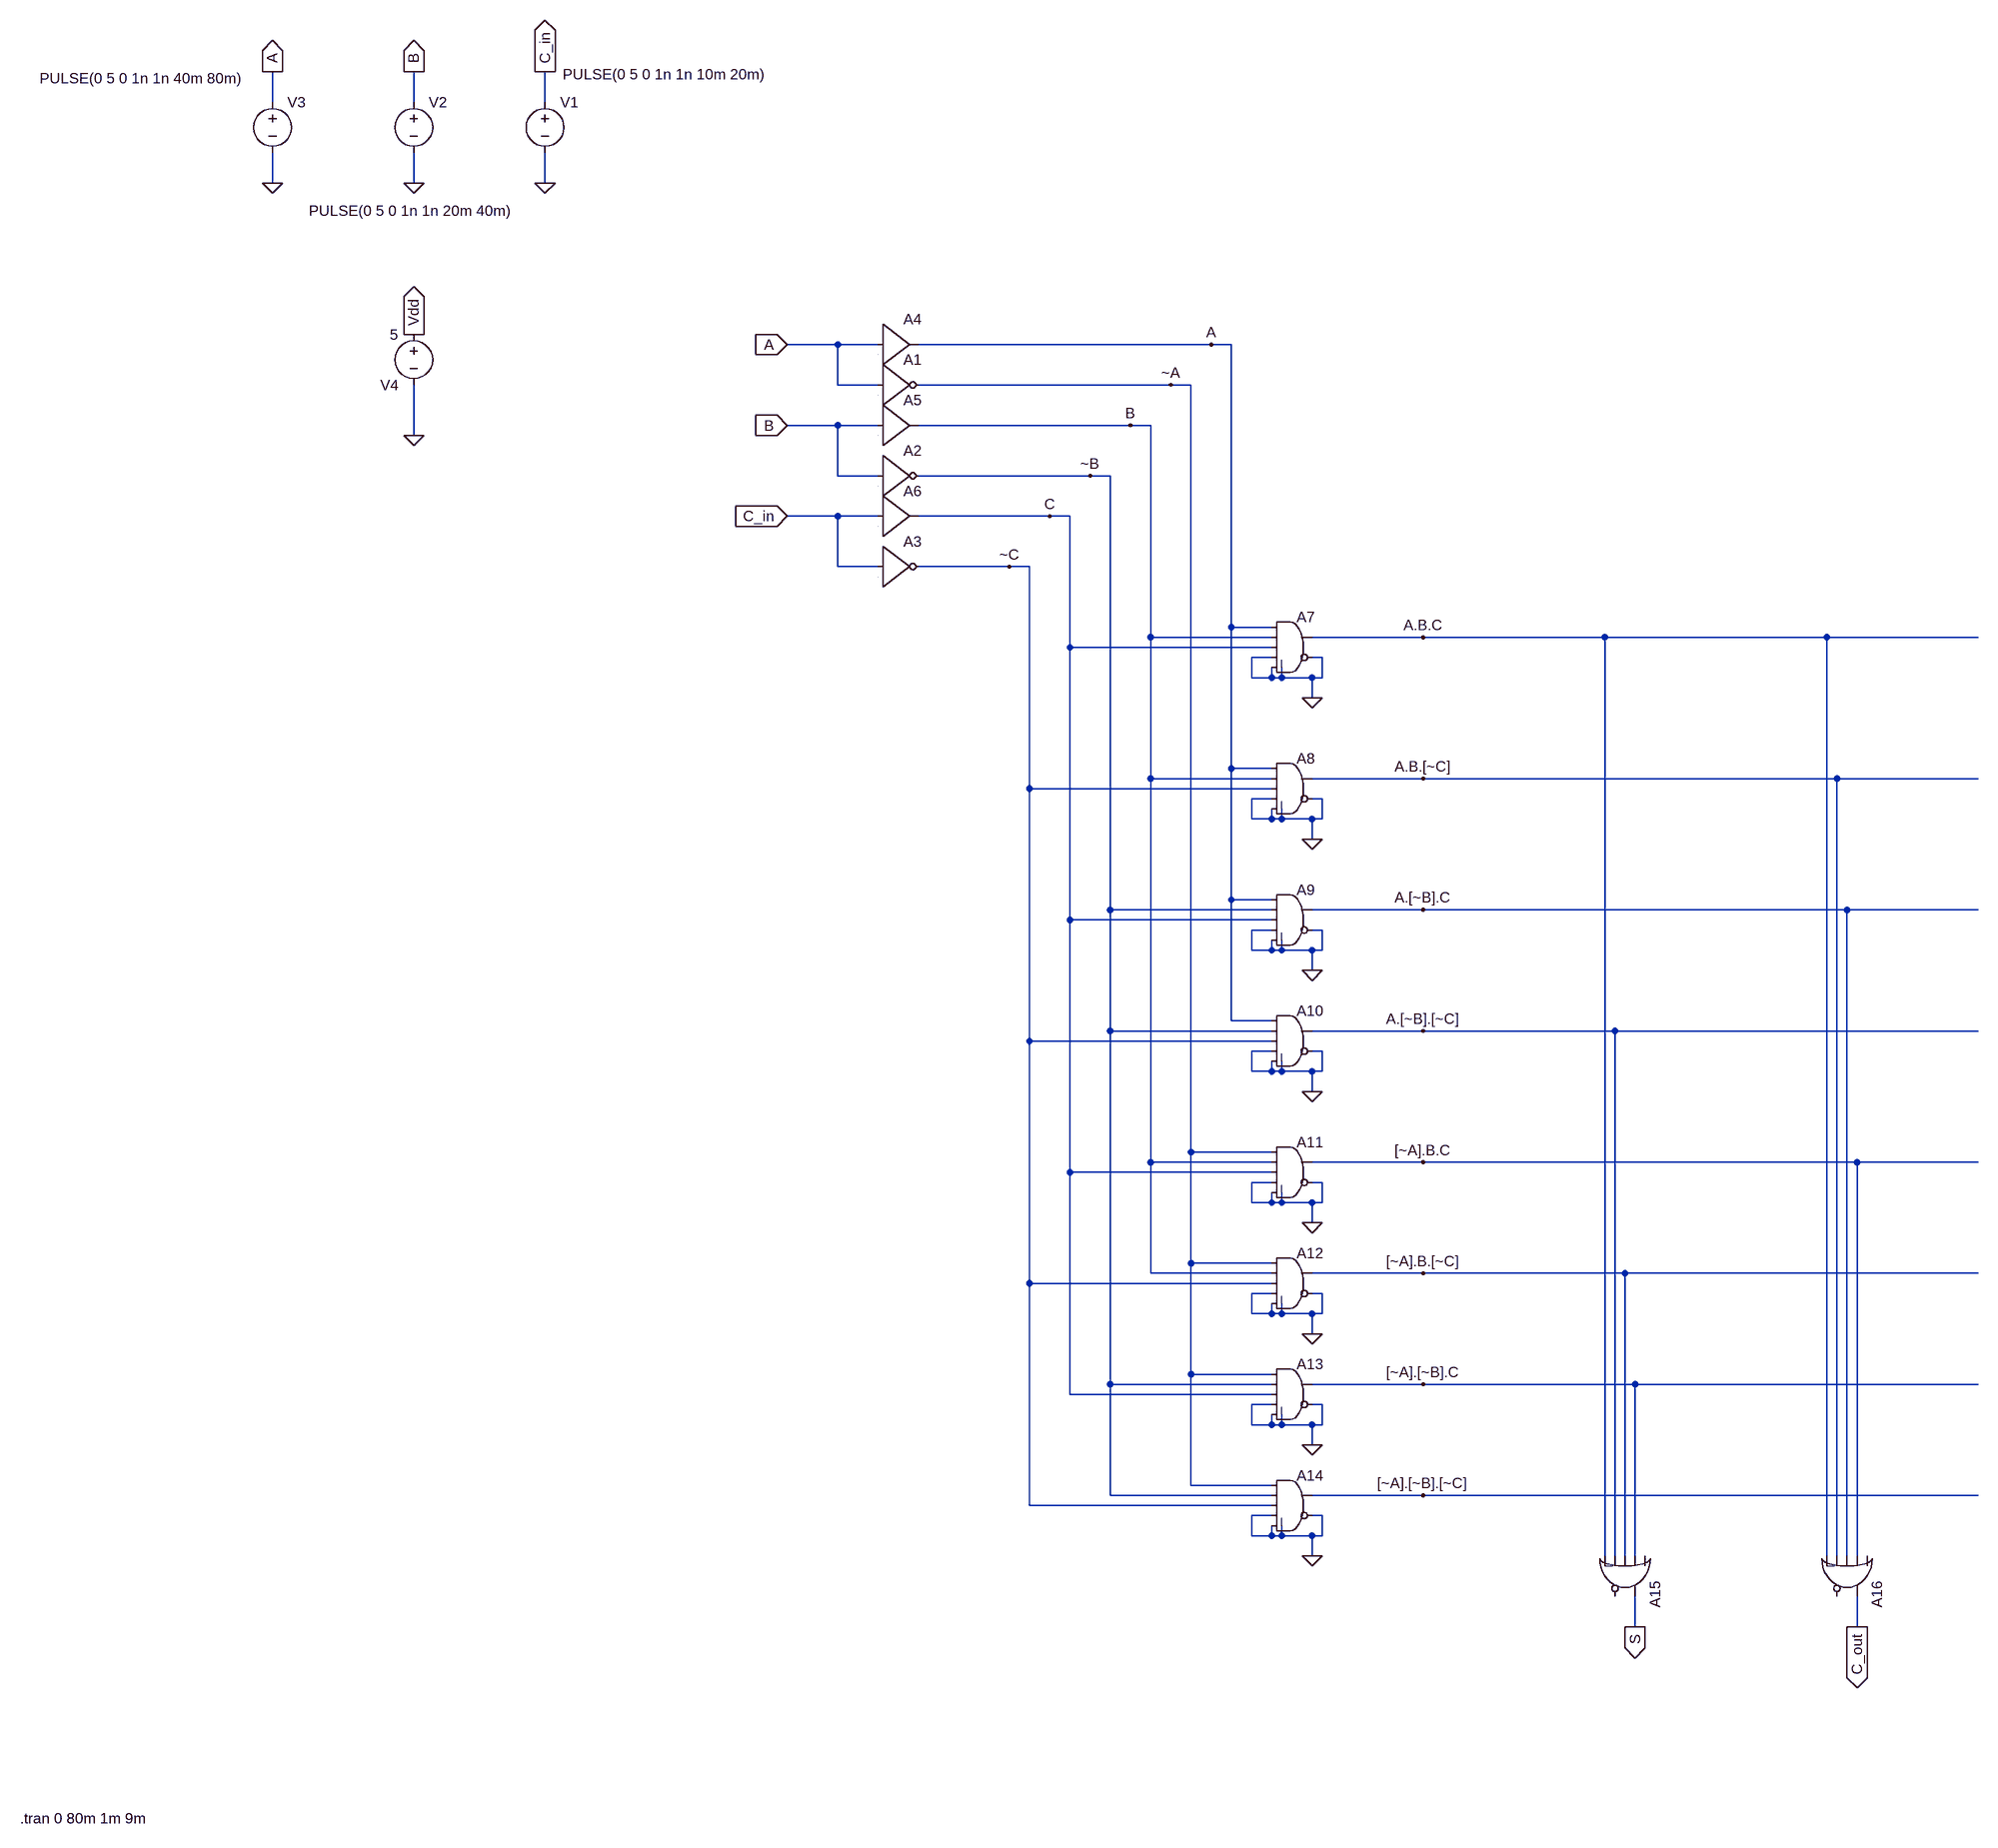
[diagram p0: schematic Full_Adder_with_AND_OR.asc]
Full_Adder_with_AND_OR.asc, the LTspice schematic file:
Version 4
SHEET 1 3172 2128
WIRE -944 -608 -944 -656
WIRE -720 -608 -720 -656
WIRE -512 -608 -512 -656
WIRE -944 -480 -944 -528
WIRE -720 -480 -720 -528
WIRE -512 -480 -512 -528
WIRE -48 -224 -128 -224
WIRE 16 -224 -48 -224
WIRE 544 -224 80 -224
WIRE 576 -224 544 -224
WIRE -48 -160 -48 -224
WIRE 16 -160 -48 -160
WIRE 480 -160 80 -160
WIRE 512 -160 480 -160
WIRE -48 -96 -128 -96
WIRE 16 -96 -48 -96
WIRE 416 -96 80 -96
WIRE 448 -96 416 -96
WIRE -720 -80 -720 -160
WIRE -48 -16 -48 -96
WIRE 16 -16 -48 -16
WIRE 352 -16 80 -16
WIRE 384 -16 352 -16
WIRE -48 48 -128 48
WIRE 16 48 -48 48
WIRE 288 48 80 48
WIRE 320 48 288 48
WIRE -48 128 -48 48
WIRE 16 128 -48 128
WIRE 224 128 80 128
WIRE 256 128 224 128
WIRE 576 224 576 -224
WIRE 640 224 576 224
WIRE 448 240 448 -96
WIRE 640 240 448 240
WIRE 880 240 704 240
WIRE 1168 240 880 240
WIRE 1520 240 1168 240
WIRE 1760 240 1520 240
WIRE 320 256 320 48
WIRE 640 256 320 256
WIRE 640 272 608 272
WIRE 720 272 704 272
WIRE 608 304 608 272
WIRE 640 304 640 288
WIRE 640 304 608 304
WIRE 656 304 656 288
WIRE 656 304 640 304
WIRE 704 304 656 304
WIRE 720 304 720 272
WIRE 720 304 704 304
WIRE 704 336 704 304
WIRE 576 448 576 224
WIRE 640 448 576 448
WIRE 448 464 448 240
WIRE 640 464 448 464
WIRE 880 464 704 464
WIRE 1536 464 880 464
WIRE 1760 464 1536 464
WIRE 256 480 256 128
WIRE 640 480 256 480
WIRE 640 496 608 496
WIRE 720 496 704 496
WIRE 608 528 608 496
WIRE 640 528 640 512
WIRE 640 528 608 528
WIRE 656 528 656 512
WIRE 656 528 640 528
WIRE 704 528 656 528
WIRE 720 528 720 496
WIRE 720 528 704 528
WIRE 704 560 704 528
WIRE 576 656 576 448
WIRE 640 656 576 656
WIRE 384 672 384 -16
WIRE 640 672 384 672
WIRE 880 672 704 672
WIRE 1552 672 880 672
WIRE 1760 672 1552 672
WIRE 320 688 320 256
WIRE 640 688 320 688
WIRE 640 704 608 704
WIRE 720 704 704 704
WIRE 608 736 608 704
WIRE 640 736 640 720
WIRE 640 736 608 736
WIRE 656 736 656 720
WIRE 656 736 640 736
WIRE 704 736 656 736
WIRE 720 736 720 704
WIRE 720 736 704 736
WIRE 704 768 704 736
WIRE 576 848 576 656
WIRE 640 848 576 848
WIRE 384 864 384 672
WIRE 640 864 384 864
WIRE 880 864 704 864
WIRE 1184 864 880 864
WIRE 1760 864 1184 864
WIRE 256 880 256 480
WIRE 640 880 256 880
WIRE 640 896 608 896
WIRE 720 896 704 896
WIRE 608 928 608 896
WIRE 640 928 640 912
WIRE 640 928 608 928
WIRE 656 928 656 912
WIRE 656 928 640 928
WIRE 704 928 656 928
WIRE 720 928 720 896
WIRE 720 928 704 928
WIRE 704 960 704 928
WIRE 512 1056 512 -160
WIRE 640 1056 512 1056
WIRE 448 1072 448 464
WIRE 640 1072 448 1072
WIRE 880 1072 704 1072
WIRE 1568 1072 880 1072
WIRE 1760 1072 1568 1072
WIRE 320 1088 320 688
WIRE 640 1088 320 1088
WIRE 640 1104 608 1104
WIRE 720 1104 704 1104
WIRE 608 1136 608 1104
WIRE 640 1136 640 1120
WIRE 640 1136 608 1136
WIRE 656 1136 656 1120
WIRE 656 1136 640 1136
WIRE 704 1136 656 1136
WIRE 720 1136 720 1104
WIRE 720 1136 704 1136
WIRE 704 1168 704 1136
WIRE 512 1232 512 1056
WIRE 640 1232 512 1232
WIRE 448 1248 448 1072
WIRE 640 1248 448 1248
WIRE 880 1248 704 1248
WIRE 1200 1248 880 1248
WIRE 1760 1248 1200 1248
WIRE 256 1264 256 880
WIRE 640 1264 256 1264
WIRE 640 1280 608 1280
WIRE 720 1280 704 1280
WIRE 608 1312 608 1280
WIRE 640 1312 640 1296
WIRE 640 1312 608 1312
WIRE 656 1312 656 1296
WIRE 656 1312 640 1312
WIRE 704 1312 656 1312
WIRE 720 1312 720 1280
WIRE 720 1312 704 1312
WIRE 704 1344 704 1312
WIRE 512 1408 512 1232
WIRE 640 1408 512 1408
WIRE 384 1424 384 864
WIRE 640 1424 384 1424
WIRE 880 1424 704 1424
WIRE 1216 1424 880 1424
WIRE 1760 1424 1216 1424
WIRE 320 1440 320 1088
WIRE 640 1440 320 1440
WIRE 640 1456 608 1456
WIRE 720 1456 704 1456
WIRE 608 1488 608 1456
WIRE 640 1488 640 1472
WIRE 640 1488 608 1488
WIRE 656 1488 656 1472
WIRE 656 1488 640 1488
WIRE 704 1488 656 1488
WIRE 720 1488 720 1456
WIRE 720 1488 704 1488
WIRE 704 1520 704 1488
WIRE 512 1584 512 1408
WIRE 640 1584 512 1584
WIRE 384 1600 384 1424
WIRE 640 1600 384 1600
WIRE 880 1600 704 1600
WIRE 1760 1600 880 1600
WIRE 256 1616 256 1264
WIRE 640 1616 256 1616
WIRE 640 1632 608 1632
WIRE 720 1632 704 1632
WIRE 608 1664 608 1632
WIRE 640 1664 640 1648
WIRE 640 1664 608 1664
WIRE 656 1664 656 1648
WIRE 656 1664 640 1664
WIRE 704 1664 656 1664
WIRE 720 1664 720 1632
WIRE 720 1664 704 1664
WIRE 704 1696 704 1664
WIRE 1168 1696 1168 240
WIRE 1184 1696 1184 864
WIRE 1200 1696 1200 1248
WIRE 1216 1696 1216 1424
WIRE 1520 1696 1520 240
WIRE 1536 1696 1536 464
WIRE 1552 1696 1552 672
WIRE 1568 1696 1568 1072
WIRE 1216 1808 1216 1760
WIRE 1568 1808 1568 1760
FLAG -128 -224 A
IOPIN -128 -224 In
FLAG -128 -96 B
IOPIN -128 -96 In
FLAG -128 48 C_in
IOPIN -128 48 In
FLAG 544 -224 A
FLAG 480 -160 ~A
FLAG 416 -96 B
FLAG 352 -16 ~B
FLAG 288 48 C
FLAG 224 128 ~C
FLAG -512 -480 0
FLAG -720 -480 0
FLAG -944 -480 0
FLAG -944 -656 A
IOPIN -944 -656 Out
FLAG -720 -656 B
IOPIN -720 -656 Out
FLAG -512 -656 C_in
IOPIN -512 -656 Out
FLAG 704 336 0
FLAG 1216 1808 S
IOPIN 1216 1808 Out
FLAG 704 560 0
FLAG 704 768 0
FLAG 704 960 0
FLAG 704 1168 0
FLAG 704 1344 0
FLAG 704 1520 0
FLAG 704 1696 0
FLAG -720 -80 0
FLAG -720 -240 Vdd
IOPIN -720 -240 Out
FLAG 880 240 A.B.C
FLAG 880 464 A.B.[~C]
FLAG 880 672 A.[~B].C
FLAG 880 864 A.[~B].[~C]
FLAG 880 1072 [~A].B.C
FLAG 880 1248 [~A].B.[~C]
FLAG 880 1424 [~A].[~B].C
FLAG 880 1600 [~A].[~B].[~C]
FLAG 1568 1808 C_out
IOPIN 1568 1808 Out
SYMBOL Digital\\inv 16 -224 R0
SYMATTR InstName A1
SYMATTR Value2 Vhigh=5 Vlow=0
SYMBOL Digital\\inv 16 -80 R0
SYMATTR InstName A2
SYMATTR Value2 Vhigh=5 Vlow=0
SYMBOL Digital\\inv 16 64 R0
SYMATTR InstName A3
SYMATTR Value2 Vhigh=5 Vlow=0
SYMBOL Digital\\buf1 16 -288 R0
SYMATTR InstName A4
SYMATTR Value2 Vhigh=5 Vlow=0
SYMBOL Digital\\buf1 16 -160 R0
SYMATTR InstName A5
SYMATTR Value2 Vhigh=5 Vlow=0
SYMBOL Digital\\buf1 16 -16 R0
SYMATTR InstName A6
SYMATTR Value2 Vhigh=5 Vlow=0
SYMBOL Digital\\and 672 192 R0
SYMATTR InstName A7
SYMATTR Value2 Vhigh=5 Vlow=0
SYMBOL voltage -512 -624 R0
WINDOW 123 0 0 Left 0
WINDOW 39 0 0 Left 0
WINDOW 3 28 -28 Left 2
SYMATTR Value PULSE(0 5 0 1n 1n 10m 20m)
SYMATTR InstName V1
SYMBOL voltage -720 -624 R0
WINDOW 123 0 0 Left 0
WINDOW 39 0 0 Left 0
WINDOW 3 -166 188 Left 2
SYMATTR Value PULSE(0 5 0 1n 1n 20m 40m)
SYMATTR InstName V2
SYMBOL voltage -944 -624 R0
WINDOW 123 0 0 Left 0
WINDOW 39 0 0 Left 0
WINDOW 3 -369 -22 Left 2
SYMATTR Value PULSE(0 5 0 1n 1n 40m 80m)
SYMATTR InstName V3
SYMBOL Digital\\and 672 416 R0
SYMATTR InstName A8
SYMATTR Value2 Vhigh=5 Vlow=0
SYMBOL Digital\\and 672 624 R0
SYMATTR InstName A9
SYMATTR Value2 Vhigh=5 Vlow=0
SYMBOL Digital\\and 672 816 R0
SYMATTR InstName A10
SYMATTR Value2 Vhigh=5 Vlow=0
SYMBOL Digital\\and 672 1024 R0
SYMATTR InstName A11
SYMATTR Value2 Vhigh=5 Vlow=0
SYMBOL Digital\\and 672 1200 R0
SYMATTR InstName A12
SYMATTR Value2 Vhigh=5 Vlow=0
SYMBOL Digital\\and 672 1376 R0
SYMATTR InstName A13
SYMATTR Value2 Vhigh=5 Vlow=0
SYMBOL Digital\\and 672 1552 R0
SYMATTR InstName A14
SYMATTR Value2 Vhigh=5 Vlow=0
SYMBOL voltage -720 -256 M0
WINDOW 0 24 96 Left 2
WINDOW 3 24 16 Left 2
WINDOW 123 0 0 Left 0
WINDOW 39 0 0 Left 0
SYMATTR InstName V4
SYMATTR Value 5
SYMBOL Digital\\or 1264 1728 R90
SYMATTR InstName A15
SYMATTR Value2 Vhigh=5 Vlow=0
SYMBOL Digital\\or 1616 1728 R90
SYMATTR InstName A16
SYMATTR Value2 Vhigh=5 Vlow=0
TEXT -1344 2112 Left 2 !.tran 0 80m 1m 9m

The netlist it stands for:
* Full_Adder_with_AND_OR.asc
A1 A 0 0 0 0 ~A 0 0 BUF Vhigh=5 Vlow=0
A2 B 0 0 0 0 ~B 0 0 BUF Vhigh=5 Vlow=0
A3 C_in 0 0 0 0 ~C 0 0 BUF Vhigh=5 Vlow=0
A4 A 0 0 0 0 0 A 0 BUF Vhigh=5 Vlow=0
A5 B 0 0 0 0 0 B 0 BUF Vhigh=5 Vlow=0
A6 C_in 0 0 0 0 0 C 0 BUF Vhigh=5 Vlow=0
A7 A B C 0 0 0 A.B.C 0 AND Vhigh=5 Vlow=0
V1 C_in 0 PULSE(0 5 0 1n 1n 10m 20m)
V2 B 0 PULSE(0 5 0 1n 1n 20m 40m)
V3 A 0 PULSE(0 5 0 1n 1n 40m 80m)
A8 A B ~C 0 0 0 A.B.[~C] 0 AND Vhigh=5 Vlow=0
A9 A ~B C 0 0 0 A.[~B].C 0 AND Vhigh=5 Vlow=0
A10 A ~B ~C 0 0 0 A.[~B].[~C] 0 AND Vhigh=5 Vlow=0
A11 ~A B C 0 0 0 [~A].B.C 0 AND Vhigh=5 Vlow=0
A12 ~A B ~C 0 0 0 [~A].B.[~C] 0 AND Vhigh=5 Vlow=0
A13 ~A ~B C 0 0 0 [~A].[~B].C 0 AND Vhigh=5 Vlow=0
A14 ~A ~B ~C 0 0 0 [~A].[~B].[~C] 0 AND Vhigh=5 Vlow=0
V4 Vdd 0 5
A15 0 [~A].[~B].C [~A].B.[~C] A.[~B].[~C] A.B.C 0 S 0 OR Vhigh=5 Vlow=0
A16 0 [~A].B.C A.[~B].C A.B.[~C] A.B.C 0 C_out 0 OR Vhigh=5 Vlow=0
.tran 0 80m 1m 9m
.backanno
.end